# Altium schematic sheet PowerSupply.SchDoc
size A4
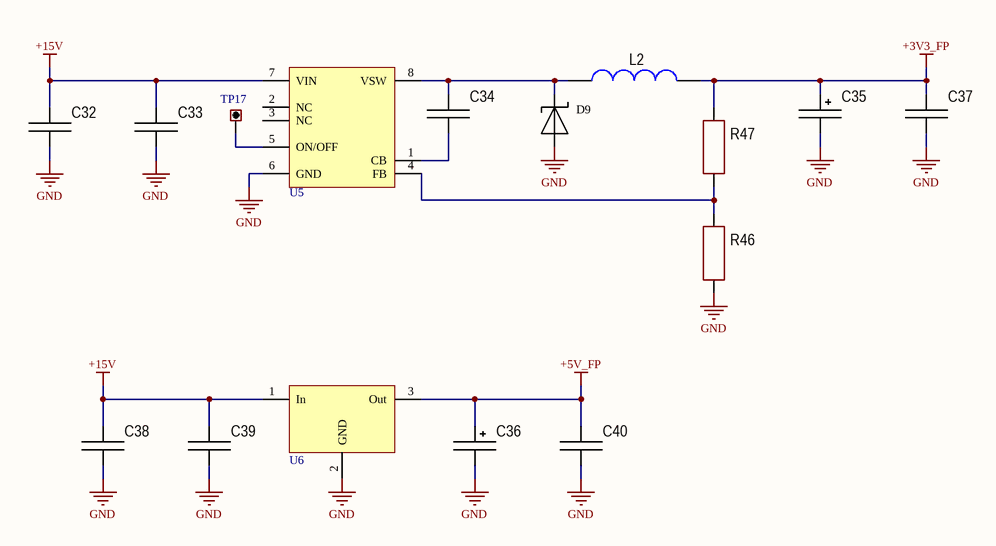
[diagram p0: PowerSupply.SchDoc]

## Parts
C32  (no value)  [CAP: 1210]
C33  (no value)  [CAP: 1206]
C34  (no value)  [CAP: 1206]
C35  (no value)  [CAPAE7866X58L]
C36  (no value)  [CAPAE7866X58L]
C37  (no value)  [CAP: 1206]
C38  (no value)  [CAP: 1210]
C39  (no value)  [CAP: 1206]
C40  (no value)  [CAP: 1206]
D9  (no value)  [DIODE: SMB]
L2  (no value)  [7447720181@WURTH]
R46  (no value)  [RES: 1206]
R47  (no value)  [RES: 1206]
TP17  Test_Point  [Test_Point]  (value not drawn)  (no BOM)
U5  (no value)  [8-SOIC]
U6  (no value)  [DPAK]

## Nets
+3V3_FP: C35.1 C37.2 L2.1 R47.2
+5V_FP: C36.1 C40.2 U6.3(Out)
+15V: C32.2 C33.2 C38.2 C39.2 U5.7(VIN) U6.1(In)
GND: C32.1 C33.1 C35.2 C36.2 C37.1 C38.1 C39.1 C40.1 D9.1 R46.1 U5.6(GND) U6.2(GND)
NetC34_1: C34.1 U5.1(CB)
NetC34_2: C34.2 D9.2 L2.2 U5.8(VSW)
NetR46_2: R46.2 R47.1 U5.4(FB)
NetTP17_1: TP17.1 U5.5(ON/OFF)

Not connected (* = marked no-connect by the designer): U5 2(NC) 3(NC)

## Library data of the parts
C32 = Ceramic_1206: Manufacturer: Yageo; PartNumber: CC1206KRX7R9BB104; ValueManufacturerPartNumber: Ceramic capacitor, 22μF, 1206; TypeCapacitor: Ceramic capacitor; Tolerance: ±10%; TypeDielectric: X7R; Voltage: 35V; Value: 22μF; Package: 1206; HelpURL: https://www.digikey.com/product-detail/en/yageo/CC1206KRX7R9BB104/311-1179-1-ND/303089; Temperature: -55...+125°C
C33 C37 C40 = Ceramic_1206: Manufacturer: Yageo; PartNumber: CC1206KRX7R9BB104; ValueManufacturerPartNumber: Ceramic capacitor, 0.1μF, 1206; TypeCapacitor: Ceramic capacitor; Tolerance: ±10%; TypeDielectric: X7R; Voltage: 50V; Value: 0.1μF; Package: 1206; HelpURL: https://www.digikey.com/product-detail/en/yageo/CC1206KRX7R9BB104/311-1179-1-ND/303089; Temperature: -55...+125°C
C34 C39 = Ceramic_1206: Manufacturer: Yageo; PartNumber: CC1206KRX7R9BB104; ValueManufacturerPartNumber: Ceramic capacitor, 10nF, 1206; TypeCapacitor: Ceramic capacitor; Tolerance: ±10%; TypeDielectric: X7R; Voltage: 50V; Value: 10nF; Package: 1206; HelpURL: https://www.digikey.com/product-detail/en/yageo/CC1206KRX7R9BB104/311-1179-1-ND/303089; Temperature: -55...+125°C
C35 C36 = Aluminium: Manufacturer: Wurth; PartNumber: EEEFK1E470P; ValueManufacturerPartNumber: Aluminium capacitor, EEEFK1E470P, 47μF, 25V, D; TypeCapacitor: Aluminium capacitor; Tolerance: ±20%; Impedance: 54mOhm; Voltage: 25V; Value: 47μF; Package: D; HelpURL: https://www.digikey.com/product-detail/en/wurth-electronics-inc/860080475013/732-9029-1-ND/5728972; Temperature: -55...+105°C
C38 = Ceramic_1206: Manufacturer: Yageo; PartNumber: CC1206KRX7R9BB104; ValueManufacturerPartNumber: Ceramic capacitor, 22μF, 1206; TypeCapacitor: Ceramic capacitor; Tolerance: ±10%; TypeDielectric: X7R; Voltage: 50V; Value: 22μF; Package: 1206; HelpURL: https://www.digikey.com/product-detail/en/yageo/CC1206KRX7R9BB104/311-1179-1-ND/303089; Temperature: -55...+125°C
D9 = MBRS260T3G: ValueManufacturerPartNumber: MBRS260T3G, SMB; Package: SMB; PartNumber: MBRS260T3G
L2 = Inductor_0805: Manufacturer: WURTH; PartNumber: 7447720181; ValueManufacturerPartNumber: Fixed inductor, WURTH, 7447720181, 180μH; TypeInductor: Fixed inductor; MaxCurrent: 1A; Tolerance: ±20%; Value: 180μH; Package: 0805; HelpURL: https://www.digikey.com/product-detail/en/murata-electronics-north-america/LQM21FN100M70L/490-4029-1-ND/1016289; Temperature: -55...+125°C
R46 = Resistor_1206: Manufacturer: Yageo; PartNumber: RC1206JR-07100RL; ValueManufacturerPartNumber: Resistor, 1K, 1206; Power: 0.25W; Tolerance: ±5%; Value: 1K; Package: 1206; HelpURL: https://www.digikey.com/product-detail/en/yageo/RC1206JR-07100RL/311-100ERCT-ND/732153; Temperature: -55...+125°C; TypeResistor: Resistor
R47 = Resistor_1206: Manufacturer: Yageo; PartNumber: RC1206JR-07100RL; ValueManufacturerPartNumber: Resistor, 1.74K, 1206; Power: 0.25W; Tolerance: ±5%; Value: 1.74K; Package: 1206; HelpURL: https://www.digikey.com/product-detail/en/yageo/RC1206JR-07100RL/311-100ERCT-ND/732153; Temperature: -55...+125°C; TypeResistor: Resistor
U5 = LM2675: ValueManufacturerPartNumber: LM2675, SOIC-8; Package: SOIC-8; PartNumber: LM2675
U6 = LM78M05CDT: ValueManufacturerPartNumber: LM78M05CDT, DPAK; Package: DPAK; PartNumber: LM78M05CDT